# Altium schematic sheet main sch.SchDoc
size A4
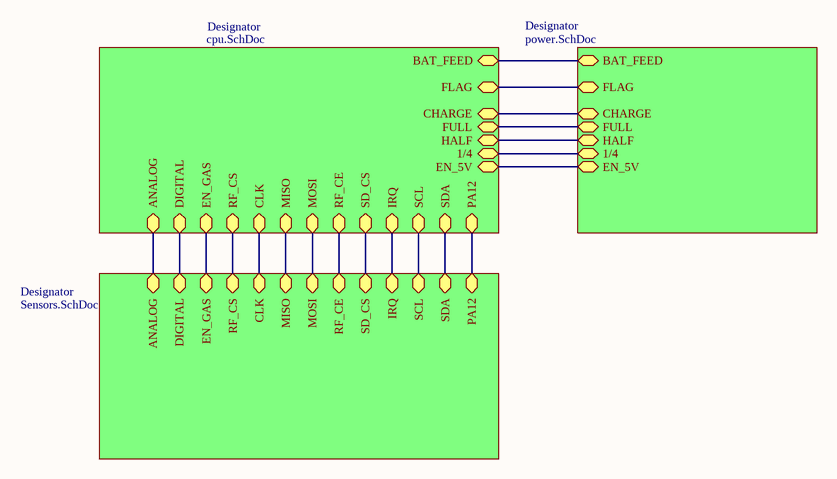
[diagram p0: main sch.SchDoc]

## Sub-sheets
Designator = cpu.SchDoc: RF_CS, CLK, MISO, MOSI, RF_CE, SD_CS, IRQ, SCL, SDA, BAT_FEED, FLAG, PA12, CHARGE, EN_GAS, FULL, HALF, 1/4, ANALOG, DIGITAL, EN_5V
Designator = power.SchDoc: BAT_FEED, FLAG, CHARGE, FULL, HALF, 1/4, EN_5V
Designator = Sensors.SchDoc: IRQ, PA12, MISO, RF_CS, SD_CS, CLK, MOSI, RF_CE, SDA, SCL, EN_GAS, ANALOG, DIGITAL

## Nets
(unnamed): sheet Designator/RF_CS, sheet Designator/RF_CS
(unnamed): sheet Designator/CLK, sheet Designator/CLK
(unnamed): sheet Designator/MISO, sheet Designator/MISO
(unnamed): sheet Designator/MOSI, sheet Designator/MOSI
(unnamed): sheet Designator/RF_CE, sheet Designator/RF_CE
(unnamed): sheet Designator/SD_CS, sheet Designator/SD_CS
(unnamed): sheet Designator/IRQ, sheet Designator/IRQ
(unnamed): sheet Designator/SCL, sheet Designator/SCL
(unnamed): sheet Designator/SDA, sheet Designator/SDA
(unnamed): sheet Designator/BAT_FEED, sheet Designator/BAT_FEED
(unnamed): sheet Designator/FLAG, sheet Designator/FLAG
(unnamed): sheet Designator/PA12, sheet Designator/PA12
(unnamed): sheet Designator/CHARGE, sheet Designator/CHARGE
(unnamed): sheet Designator/EN_GAS, sheet Designator/EN_GAS
(unnamed): sheet Designator/FULL, sheet Designator/FULL
(unnamed): sheet Designator/HALF, sheet Designator/HALF
(unnamed): sheet Designator/1/4, sheet Designator/1/4
(unnamed): sheet Designator/ANALOG, sheet Designator/ANALOG
(unnamed): sheet Designator/DIGITAL, sheet Designator/DIGITAL
(unnamed): sheet Designator/EN_5V, sheet Designator/EN_5V